# EasyEDA Pro project 模拟题1.epro

# Board LIB
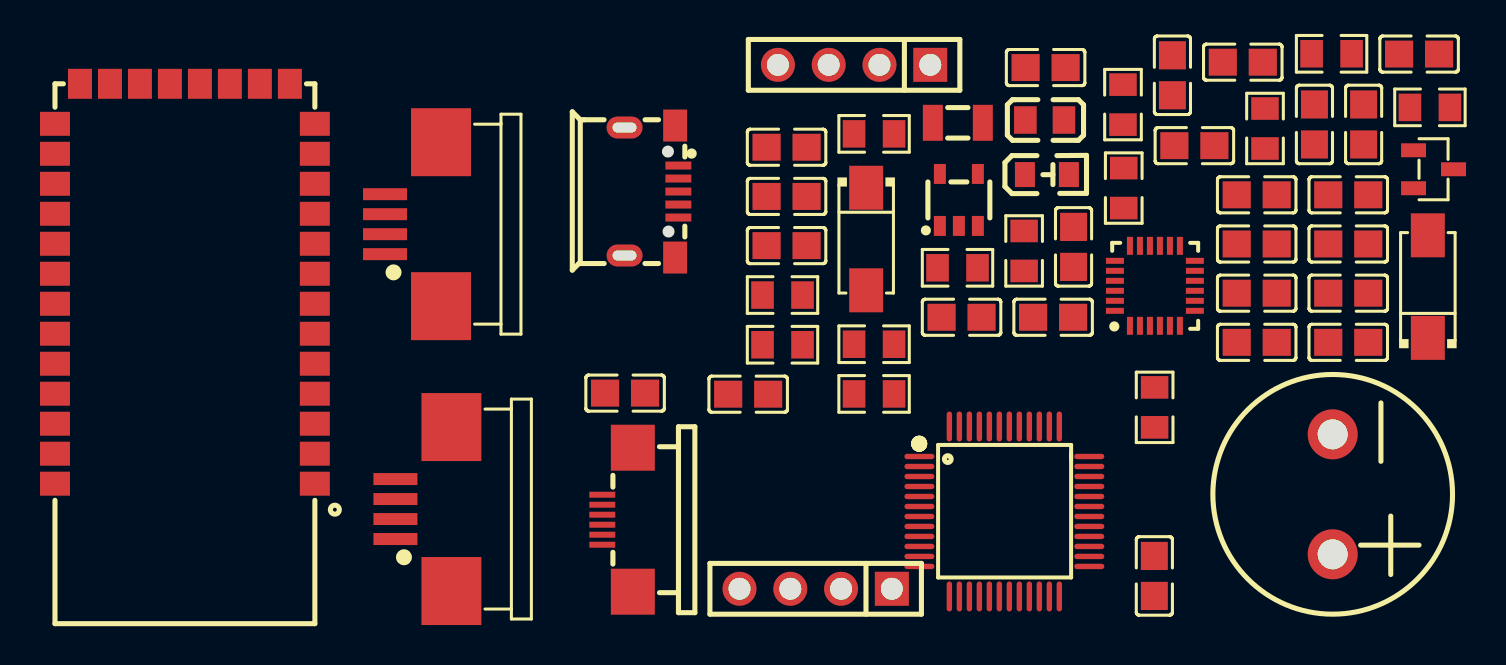
[diagram p0: board, top side]
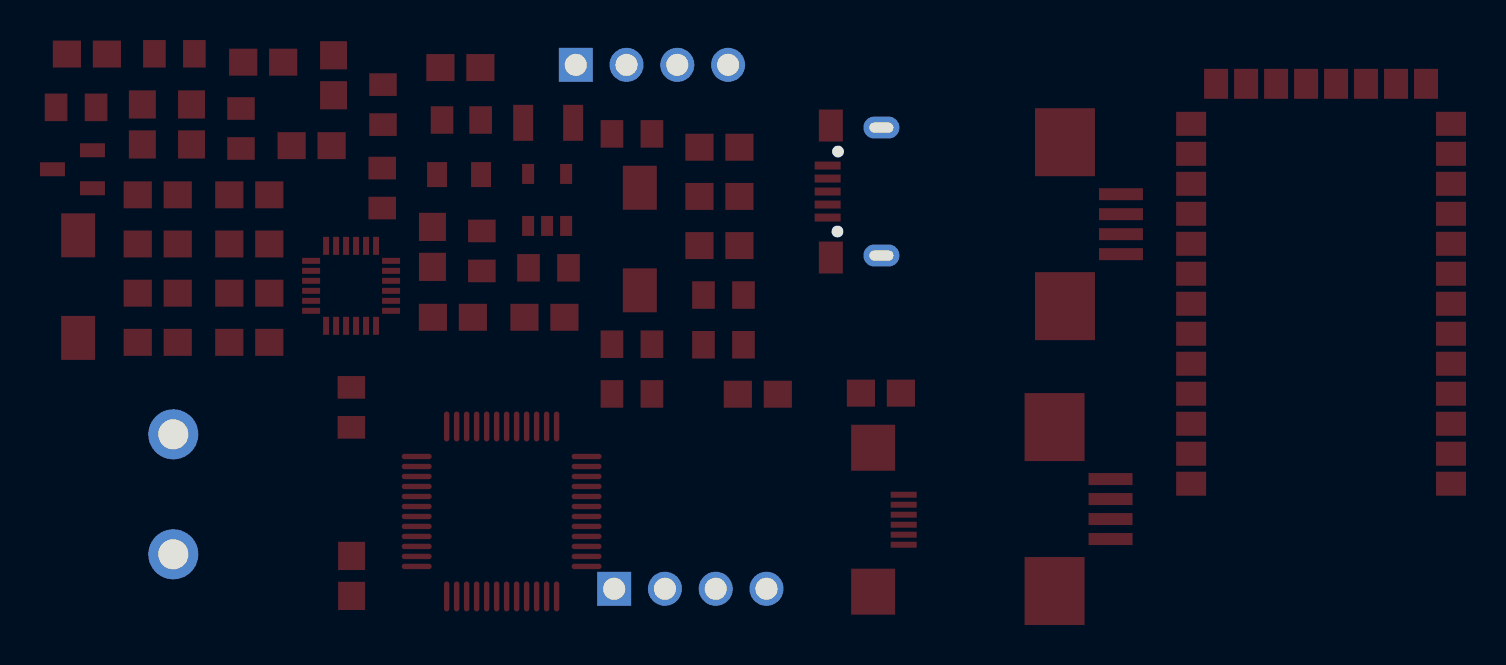
[diagram p1: board, bottom side, seen from below]

Outline 0.62 x 4.59 mm; copper layers: Top Layer, Bottom Layer. Coordinates in mm from the lower left corner of the outline.
Stack: Top Layer 0.035mm / Dielectric1 1.51mm FR4 er 4.5 / Bottom Layer 0.035mm

## Design rules (mm)
template: JLCPCB Capability(Two Layers Board)
spacing copperThickness1oz (default): track to track 0.102, other pairs 0.152 to 0.3
spacing copperThickness2oz: track to track 0.203, other pairs 0.152 to 0.3
track width copperThickness1oz (default): min 0.127, default 0.254, max 2.54
track width copperThickness2oz: min 0.203, default 0.254, max 2.54
differential pair differentialPair (default): width min 0.127, default 0.254, max 2.54; gap min 0.152, default 0.152
via viaSize (default): diameter min 0.5, default 0.61, max 10; hole min 0.3, default 0.305, max 6.3

## Placement (name value [footprint] x y rotation side)
?  -  [R0805]  6.03 -5.37 0 top
?#2  -  [R0805]  10.61 5.18 0 top
?#3  -  [R0805]  18.11 -0.67 90 top
?#4  -  [R0805]  10.61 -7.83 180 top
?#5  -  [R0805]  6.03 -2.88 0 top
?#6  -  [R0805]  10.61 -5.34 180 top
?#7  -  [R0805]  23.1 2.47 90 top
?#8  -  [R0805]  23.06 6.65 90 top
?#9  -  [R0805]  33.49 9.19 180 top
?#10  -  [R0805]  38.41 6.51 180 top
?#11  -  [R0805]  30.16 5.45 90 top
?#12  -  [R0805]  14.78 -1.52 0 top
?#13  -  [R0805]  24.64 -8.5 90 top
?#14  -  [L0805]  19.14 5.88 180 top
?#15  -  [BUZ-TH_BD12.0-P6.00-D0.9-RD]  33.55 -12.85 270 top
?#16  -  [SMA_L4.2-W2.6-LS5.3-RD]  10.21 -0.08 270 top
?#17  -  [SMA_L4.2-W2.6-LS5.3-RD]  38.31 -2.46 90 top
?#18  -  [FPC-SMD_6P-L9.3-W4.1-P0.50]  -2.22 -14.12 90 top
?#19  -  [HDR-TH_4P-P2.54-V-F]  9.61 8.63 180 top
?#20  -  [HDR-TH_4P-P2.54-V-F]  7.69 -17.57 180 top
?#21  -  [FPC-SMD_4P-P1.00_AFA07-S04ECC-00]  -11.93 -13.58 90 top
?#22  -  [FPC-SMD_4P-P1.00_AFA07-S04ECC-00]  -12.46 0.66 90 top
?#23  -  [C0805]  29.75 -2.79 0 top
?#24  -  [C0805]  26.63 4.59 180 top
?#25  -  [C0805]  19.19 8.5 0 top
?#26  -  [C0805]  32.64 5.65 90 top
?#27  -  [C0805]  6.23 4.51 0 top
?#28  -  [C0805]  37.87 9.17 0 top
?#29  -  [C0805]  35.1 5.65 90 top
?#30  -  [C0805]  19.56 -3.99 0 top
?#31  -  [C0805]  14.99 -3.99 180 top
?#32  -  [C0805]  29.75 -0.33 180 top
?#33  -  [C0805]  6.23 -0.41 180 top
?#34  -  [C0805]  29.75 2.13 180 top
?#35  -  [C0805]  25.53 8.11 90 top
?#36  -  [C0805]  29.05 8.77 0 top
?#37  -  [C0805]  6.23 2.05 0 top
?#38  -  [C0805]  34.33 -0.33 180 top
?#39  -  [C0805]  29.75 -5.25 0 top
?#40  -  [C0805]  34.33 -2.79 180 top
?#41  -  [C0805]  24.63 -16.93 90 top
?#42  -  [C0805]  -1.85 -7.78 0 top
?#43  -  [C0805]  20.59 -0.47 270 top
?#44  -  [C0805]  34.33 -5.25 180 top
?#45  -  [C0805]  34.33 2.13 0 top
?#46  -  [C0805]  4.31 -7.84 0 top
?#47  -  [BULETM-SMD_HC-05]  -23.87 -2.32 180 top
?#48  -  [SOT-23-5_L3.0-W1.7-P0.95-LS2.8-BR]  14.85 1.88 270 top
?#49  -  [QFN-24_L4.0-W4.0-P0.50-BL]  24.66 -2.42 0 top
?#50  -  [LQFP-48_L7.0-W7.0-P0.50-LS9.0-BL]  17.13 -13.7 270 top
?#51  -  [FC-135R_L3.2-W1.5]  14.8 5.73 180 top
?#52  -  [LED_0805]  19.3 3.14 0 top
?#53  -  [SOT-23-3_L2.9-W1.3-P1.90-LS2.4-BR]  38.59 3.41 180 top
?#54  -  [USB-SMD_5P_MICROUSB-5PIN]  -0.53 2.3 270 top

## Footprints (pads in the part's own frame, mm; a bottom-side part is the same pattern mirrored in y, then rotated)
BULETM-SMD_HC-05
  rect 1.5x1.2 smd: 1(-6.5,10) 2(-6.5,8.5) 3(-6.5,7) 4(-6.5,5.5) 5(-6.5,4) 6(-6.5,2.5) 7(-6.5,1) 8(-6.5,-0.5) 9(-6.5,-2) 10(-6.5,-3.5) 11(-6.5,-5) 12(-6.5,-6.5) 13(-6.5,-8) 22(6.5,-8) 23(6.5,-6.5) 24(6.5,-5) 25(6.5,-3.5) 26(6.5,-2) 27(6.5,-0.5) 28(6.5,1) 29(6.5,2.5) 30(6.5,4) 31(6.5,5.5) 32(6.5,7) 33(6.5,8.5) 34(6.5,10)
  rect 1.2x1.5 smd: 14(-5.25,-10) 15(-3.75,-10) 16(-2.25,-10) 17(-0.75,-10) 18(0.75,-10) 19(2.25,-10) 20(3.75,-10) 21(5.25,-10)
BUZ-TH_BD12.0-P6.00-D0.9-RD
  round 2.5 hole 1.5: 1(-3,0) 2(3,0)
C0805
  rect 1.41x1.35 smd: 1(-1,0) 2(1,0)
FC-135R_L3.2-W1.5
  rect 1x1.8 smd: 1(-1.25,0) 2(1.25,0)
FPC-SMD_4P-P1.00_AFA07-S04ECC-00
  rect 0.6x2.2 smd: 1(-1.5,1.4) 2(-0.5,1.4) 3(0.5,1.4) 4(1.5,1.4)
  rect 3.4x3 smd: 5(4.1,-1.4) 6(-4.1,-1.4)
FPC-SMD_6P-L9.3-W4.1-P0.50
  rect 0.3x1.3 smd: 1(-1.25,0.764) 2(-0.75,0.764) 3(-0.25,0.764) 4(0.25,0.764) 5(0.75,0.764) 6(1.25,0.764)
  rect 2.3x2.2 smd: 7(-3.6,-0.764) 8(3.6,-0.764)
HDR-TH_4P-P2.54-V-F
  rect 1.7x1.7 hole 1.1: 1(-3.81,0)
  round 1.7 hole 1.1: 2(-1.27,0) 3(1.27,0) 4(3.81,0)
L0805
  rect 1.133x1.377 smd: 1(-0.966,0) 2(0.966,0)
LED_0805
  rect 1x1.25 smd: 1(-1.15,0.005) 2(1.05,0.005)
LQFP-48_L7.0-W7.0-P0.50-LS9.0-BL
  oval 0.27x1.5 smd: 1(-2.75,-4.25) 2(-2.25,-4.25) 3(-1.75,-4.25) 4(-1.25,-4.25) 5(-0.75,-4.25) 6(-0.25,-4.25) 7(0.25,-4.25) 8(0.75,-4.25) 9(1.25,-4.25) 10(1.75,-4.25) 11(2.25,-4.25) 12(2.75,-4.25) 25(2.75,4.25) 26(2.25,4.25) 27(1.75,4.25) 28(1.25,4.25) 29(0.75,4.25) 30(0.25,4.25) 31(-0.25,4.25) 32(-0.75,4.25) 33(-1.25,4.25) 34(-1.75,4.25) 35(-2.25,4.25) 36(-2.75,4.25)
  oval 1.5x0.27 smd: 13(4.25,-2.75) 14(4.25,-2.25) 15(4.25,-1.75) 16(4.25,-1.25) 17(4.25,-0.75) 18(4.25,-0.25) 19(4.25,0.25) 20(4.25,0.75) 21(4.25,1.25) 22(4.25,1.75) 23(4.25,2.25) 24(4.25,2.75) 37(-4.25,2.75) 38(-4.25,2.25) 39(-4.25,1.75) 40(-4.25,1.25) 41(-4.25,0.75) 42(-4.25,0.25) 43(-4.25,-0.25) 44(-4.25,-0.75) 45(-4.25,-1.25) 46(-4.25,-1.75) 47(-4.25,-2.25) 48(-4.25,-2.75)
QFN-24_L4.0-W4.0-P0.50-BL
  rect 0.3x0.9 smd: 1(-1.25,-2) 2(-0.75,-2) 3(-0.25,-2) 4(0.25,-2) 5(0.75,-2) 6(1.25,-2) 13(1.25,2) 14(0.75,2) 15(0.25,2) 16(-0.25,2) 17(-0.75,2) 18(-1.25,2)
  rect 0.9x0.3 smd: 7(2,-1.25) 8(2,-0.75) 9(2,-0.25) 10(2,0.25) 11(2,0.75) 12(2,1.25) 19(-2,1.25) 20(-2,0.75) 21(-2,0.25) 22(-2,-0.25) 23(-2,-0.75) 24(-2,-1.25)
R0805
  rect 1.133x1.377 smd: 1(-1,0) 2(1,0)
SMA_L4.2-W2.6-LS5.3-RD
  rect 2.2x1.7 smd: 1(-2.566,0) 2(2.566,0)
SOT-23-3_L2.9-W1.3-P1.90-LS2.4-BR
  rect 1.25x0.7 smd: 1(1,-0.95) 2(1,0.95) 3(-1,0)
SOT-23-5_L3.0-W1.7-P0.95-LS2.8-BR
  rect 1x0.6 smd: 1(1.3,-0.95) 2(1.3,0) 3(1.3,0.95) 4(-1.3,0.95) 5(-1.3,-0.95)
USB-SMD_5P_MICROUSB-5PIN
  rect 0.4x1.3 smd: 1(-1.3,1.345) 2(-0.65,1.345) 3(0,1.345) 4(0.65,1.345) 5(1.3,1.345)
  rect 1.6x1.2 smd: 6(3.3,1.185) 7(-3.3,1.185)
  oval 1.1x1.8 hole 0.5x1.2: 8(3.2,-1.345) 9(-3.2,-1.345)

## Nets
GND: ?#5.2 ?#6.2 ?#11.1 ?#18.1 ?#18.7 ?#18.8 ?#19.3 ?#20.4 ?#21.5 ?#21.6 ?#22.4 ?#22.5 ?#22.6 ?#23.2 ?#24.2 ?#25.1 ?#26.1 ?#27.1 ?#28.1 ?#29.1 ?#30.2 ?#31.2 ?#32.2 ?#33.2 ?#34.2 ?#35.2 ?#36.2 ?#37.1 ?#38.1 ?#39.1 ?#40.1 ?#41.1 ?#42.1 ?#43.1 ?#44.1 ?#45.1 ?#46.2 ?#47.13 ?#47.21 ?#47.22 ?#48.2 ?#49.1 ?#49.9 ?#49.11 ?#49.18 ?#50.8 ?#50.23 ?#50.35 ?#50.47 ?#53.2 ?#54.5 ?#54.6 ?#54.7 ?#54.8 ?#54.9
VDD: ?.2 ?#2.2 ?#7.1 ?#12.2 ?#13.1 ?#14.1 ?#15.1 ?#17.1 ?#18.6 ?#19.2 ?#20.3 ?#22.1 ?#28.2 ?#29.2 ?#33.1 ?#34.1 ?#35.1 ?#36.1 ?#37.2 ?#42.2 ?#45.2 ?#46.1 ?#47.12 ?#48.5 ?#49.8 ?#49.13 ?#50.1 ?#50.24 ?#50.36 ?#50.48
VDDA: ?#14.2 ?#24.1 ?#50.9
MEMS_INT: ?#13.2 ?#49.12 ?#50.18
MODULE_INT: ?#12.1 ?#18.2 ?#44.2 ?#50.19
PWR_EN: ?#18.5 ?#50.20
SCL: ?#2.1 ?#18.3 ?#22.2 ?#49.23 ?#50.42
SDA: ?.1 ?#18.4 ?#22.3 ?#49.24 ?#50.43
SUP: ?#16.1 ?#25.2 ?#26.2 ?#48.1 ?#48.3
TIMER2_CH1: ?#8.1 ?#50.17
TK_OUT1: ?#50.38
TK_OUT2: ?#50.39
TK_OUT3: ?#50.40
TK_OUT4: ?#50.41
USART1_RX: ?#10.1 ?#50.13
USART1_TX: ?#9.1 ?#50.12
USB_DM: ?#4.2 ?#50.32
USB_DP: ?#3.2 ?#50.33
$1N797: ?#15.2 ?#17.2 ?#53.3
$1N941: ?#8.2 ?#53.1
$1N1221: ?#43.2 ?#49.10
$1N1494: ?#23.1 ?#49.20
$1N2047: ?#3.1 ?#54.3
$1N2049: ?#4.1 ?#54.2
$1N2097: ?#5.1 ?#54.4
$1N2146: ?#16.2 ?#54.1
$1N2344: ?#27.2 ?#48.4
$1N2714: ?#30.1 ?#50.3 ?#51.2
$1N2721: ?#31.1 ?#50.4 ?#51.1
$1N2943: ?#6.1 ?#50.44
$1N3028: ?#7.2 ?#32.1 ?#50.7
$1N3436: ?#19.1 ?#50.37
$1N3445: ?#19.4 ?#50.34
$1N3538: ?#20.1 ?#50.31
$1N3541: ?#20.2 ?#50.30
$1N4058: ?#9.2 ?#47.1
$1N4090: ?#10.2 ?#47.2
$1N4843: ?#21.1 ?#38.2
$1N4850: ?#21.2 ?#39.2
$1N4857: ?#21.3 ?#40.2
$1N4864: ?#21.4 ?#41.2
$1N5224: ?#11.2 ?#52.1
$1N5231: ?#50.15 ?#52.2

Pads without a net: ?#47 3 4 5 6 7 8 9 10 11 14 15 16 17 18 19 20 23 24 25 26 27 28 29 30 31 32 33 34; ?#49 2 3 4 5 6 7 14 15 16 17 19 21 22; ?#50 2 5 6 10 11 14 16 21 22 25 26 27 28 29 45 46
